# EAGLE schematic LED_chaser_schematics (EAGLE 9.6.2)
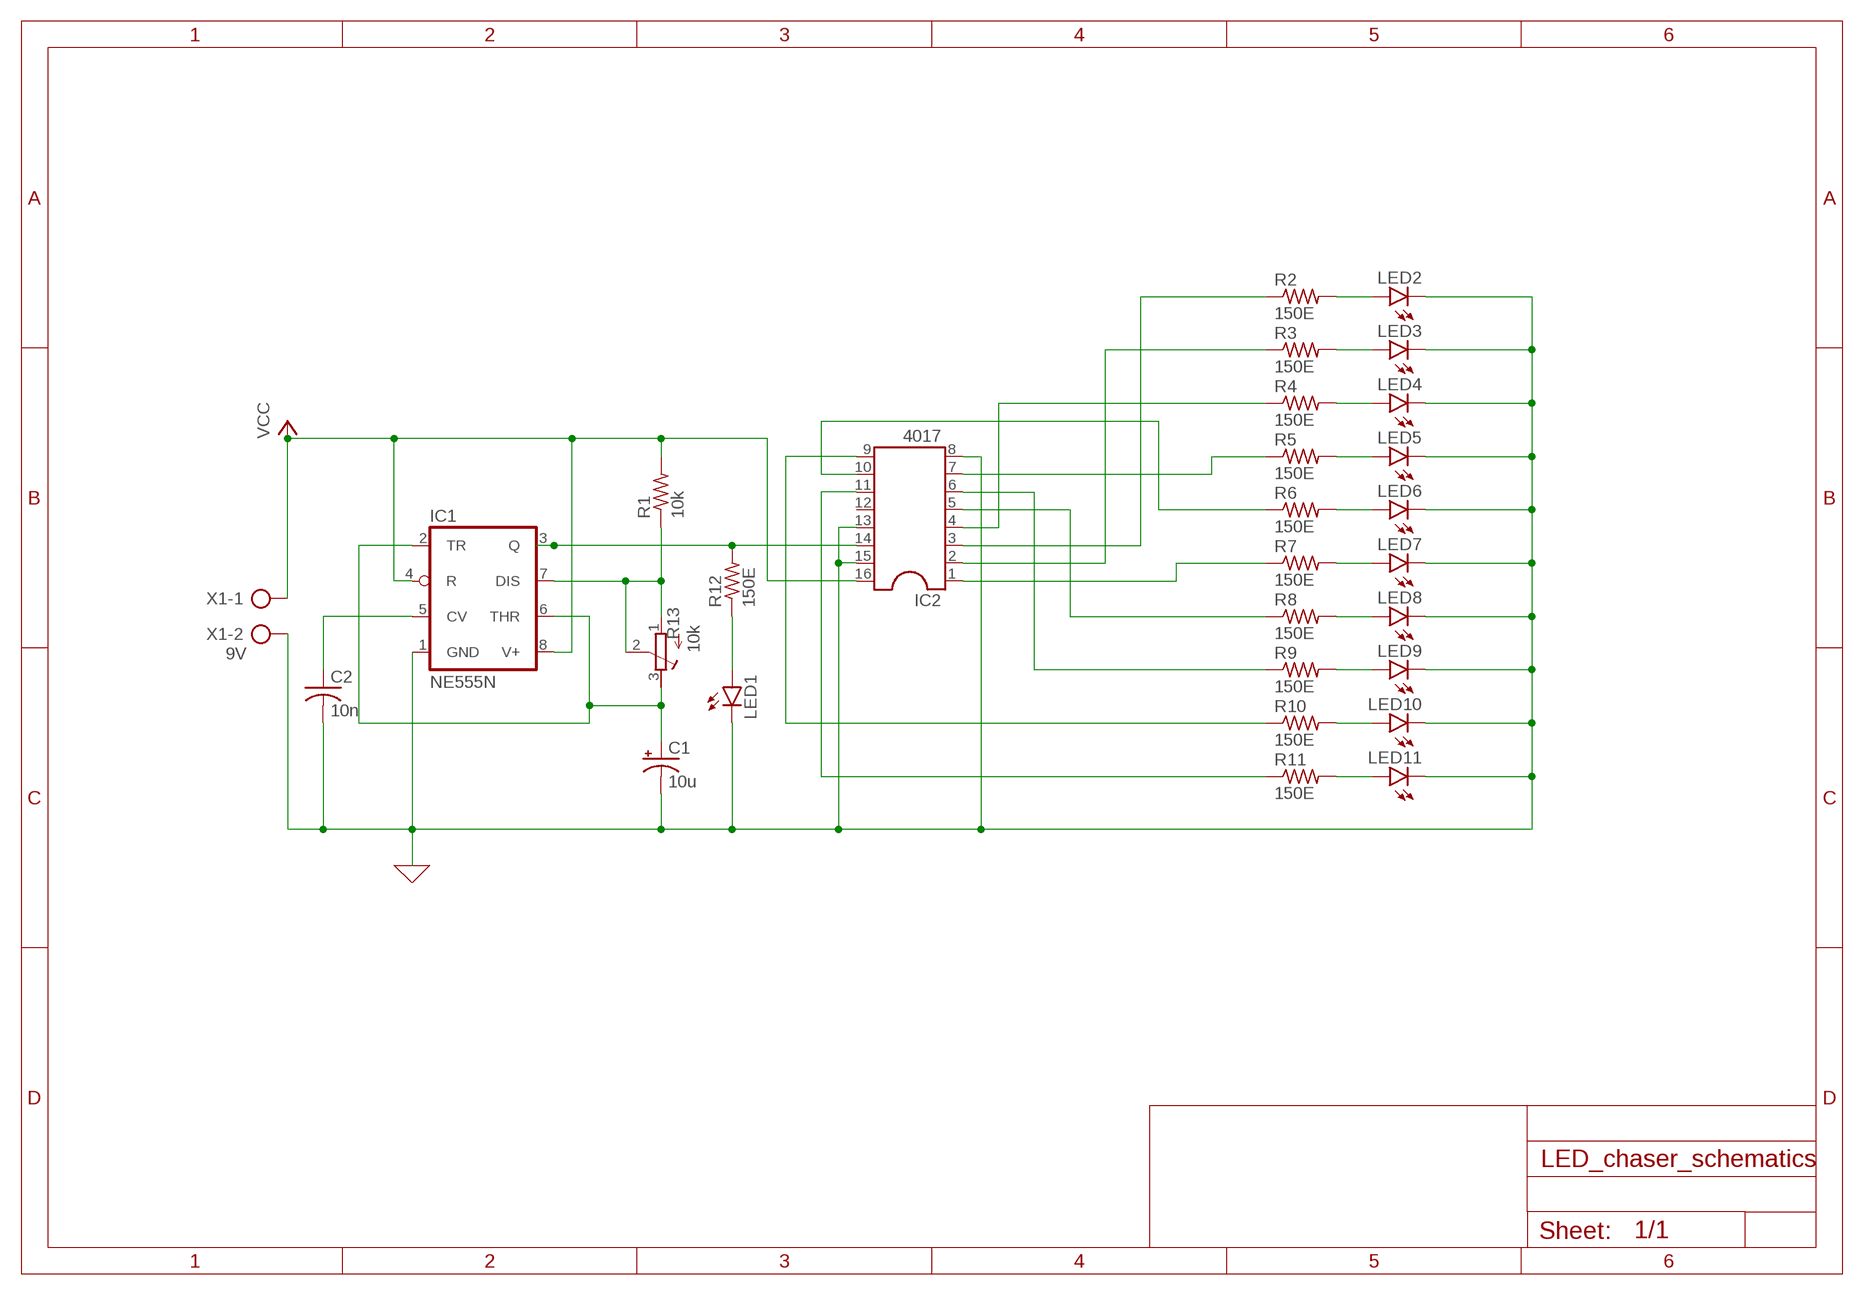
[diagram p0: schematic, sheet 1]

## Parts
C1  10u  CPOL-USE2.5-6  [E2,5-6]
C2  10n  C-US025-024X044  [C025-024X044]
IC1  NE555N  [DIL08]
IC2  4017  DIL16  [DIL16]
LED1  LED5MM  [LED5MM]
LED2  LED5MM  [LED5MM]
LED3  LED5MM  [LED5MM]
LED4  LED5MM  [LED5MM]
LED5  LED5MM  [LED5MM]
LED6  LED5MM  [LED5MM]
LED7  LED5MM  [LED5MM]
LED8  LED5MM  [LED5MM]
LED9  LED5MM  [LED5MM]
LED10  LED5MM  [LED5MM]
LED11  LED5MM  [LED5MM]
R1  10k  R-US_0207/10  [0207/10]
R2  150E  R-US_0207/10  [0207/10]
R3  150E  R-US_0207/10  [0207/10]
R4  150E  R-US_0207/10  [0207/10]
R5  150E  R-US_0207/10  [0207/10]
R6  150E  R-US_0207/10  [0207/10]
R7  150E  R-US_0207/10  [0207/10]
R8  150E  R-US_0207/10  [0207/10]
R9  150E  R-US_0207/10  [0207/10]
R10  150E  R-US_0207/10  [0207/10]
R11  150E  R-US_0207/10  [0207/10]
R12  150E  R-US_0207/10  [0207/10]
R13  10k  R-TRIMM3299W  [RTRIM3299W]
X1  9V  AK500/2  [AK500/2]

## Nets
0: C1.- C2.2 IC1.1(GND) IC2.8 IC2.13 IC2.15 LED1.K(C) LED2.K(C) LED3.K(C) LED4.K(C) LED5.K(C) LED6.K(C) LED7.K(C) LED8.K(C) LED9.K(C) LED10.K(C) LED11.K(C) X1.2 ; supply symbol labelled GND
N$1: LED2.A R2.2
N$2: LED3.A R3.2
N$3: LED4.A R4.2
N$4: LED5.A R5.2
N$5: LED6.A R6.2
N$6: LED7.A R7.2
N$7: LED8.A R8.2
N$8: LED9.A R9.2
N$9: LED10.A R10.2
N$10: LED11.A R11.2
N$12: IC2.4 R4.1
N$13: IC2.2 R3.1
N$14: IC2.6 R9.1
N$15: IC2.7 R5.1
N$16: IC2.10 R6.1
N$17: IC2.9 R10.1
N$18: IC2.5 R8.1
N$20: IC2.1 R7.1
N$21: IC2.11 R11.1
N$22: IC2.3 R2.1
N$25: IC1.3(Q) IC2.14 R12.2
N$26: LED1.A R12.1
N$28: IC1.7(DIS) R1.1 R13.1(A) R13.2(S)
N$31: C1.+ IC1.2(TR) IC1.6(THR) R13.3(E)
N$33: C2.1 IC1.5(CV)
VCC: IC1.4(R) IC1.8(V+) IC2.16 R1.2 X1.1
Unconnected: IC2.12

## Library data of the parts
C1 = rcl:CPOL-US: POLARIZED CAPACITOR, American symbol; SPICEPREFIX: C
C2 = rcl:C-US: CAPACITOR, American symbol; SPICEPREFIX: C
IC1 = linear:*555: TIMER
IC2 = ic-package:DIL16: Dual In Line / Socket
LED1-LED11 = led:LED: LED OSRAM: - CHIPLED LG R971, LG N971, LY N971, LG Q971, LY Q971, LO R971, LY R971 LH N974, LH R974 LS Q976, LO Q976, LY Q976 LO Q996 - Hyper CHIPLED LW Q18S LB Q993, LB Q99A, LB R99A - SideLED LS A670, LO A670, LY A670, LG A670, LP A670 LB A673, LV A673, LT A673, LW A673 LH A674 LY A675 LS A676, LA A676, LO A676, LY A676, LW A676 LS A679, LY A679, LG A679 - Hyper Micro SIDELED® LS Y876, LA Y876, LO Y876, LY Y876 LT Y87S - SmartLED LW L88C, LW L88S LB L89C, LB L89S, LG L890 LS L89K, LO L89K, LY L89K LS L896, LA L896, LO L896, LY L896 - TOPLED LS T670, LO T670, LY T670, LG T670, LP T670 LSG T670, LSP T670, LSY T670, LOP T670, LYG T670 LG T671, LOG T671, LSG T671 LB T673, LV T673, LT T673, LW T673 LH T674 LS T676, LA T676, LO T676, LY T676, LB T676, LH T676, LSB T676, LW T676 LB T67C, LV T67C, LT T67C, LS T67K, LO T67K, LY T67K, LW E67C LS E67B, LA E67B, LO E67B, LY E67B, LB E67C, LV E67C, LT E67C LW T67C LS T679, LY T679, LG T679 LS T770, LO T770, LY T770, LG T770, LP T770 LB T773, LV T773, LT T773, LW T773 LH T774 LS E675, LA E675, LY E675, LS T675 LS T776, LA T776, LO T776, LY T776, LB T776 LHGB T686 LT T68C, LB T68C - Hyper Mini TOPLED® LB M676 - Mini TOPLED Santana® LG M470 LS M47K, LO M47K, LY M47K Source: http://www.osram.convergy.de LUXEON: - LUMILED® LXK2-PW12-R00, LXK2-PW12-S00, LXK2-PW14-U00, LXK2-PW14-V00 LXK2-PM12-R00, LXK2-PM12-S00, LXK2-PM14-U00 LXK2-PE12-Q00, LXK2-PE12-R00, LXK2-PE12-S00, LXK2-PE14-T00, LXK2-PE14-U00 LXK2-PB12-K00, LXK2-PB12-L00, LXK2-PB12-M00, LXK2-PB14-N00, LXK2-PB14-P00, LXK2-PB14-Q00 LXK2-PR12-L00, LXK2-PR12-M00, LXK2-PR14-Q00, LXK2-PR14-R00 LXK2-PD12-Q00, LXK2-PD12-R00, LXK2-PD12-S00 LXK2-PH12-R00, LXK2-PH12-S00 LXK2-PL12-P00, LXK2-PL12-Q00, LXK2-PL12-R00 Source: www.luxeon.com KINGBRIGHT: KA-3528ASYC Source: www.kingbright.com
R1-R12 = rcl:R-US_: RESISTOR, American symbol; SPICEPREFIX: R
R13 = rcl:R-TRIMM: Trimm resistor; SPICEMODEL: X; SPICEPREFIXL: POT
X1 = con-ptr500:AK500/2: CONNECTOR; OC_FARNELL: unknown; OC_NEWARK: unknown